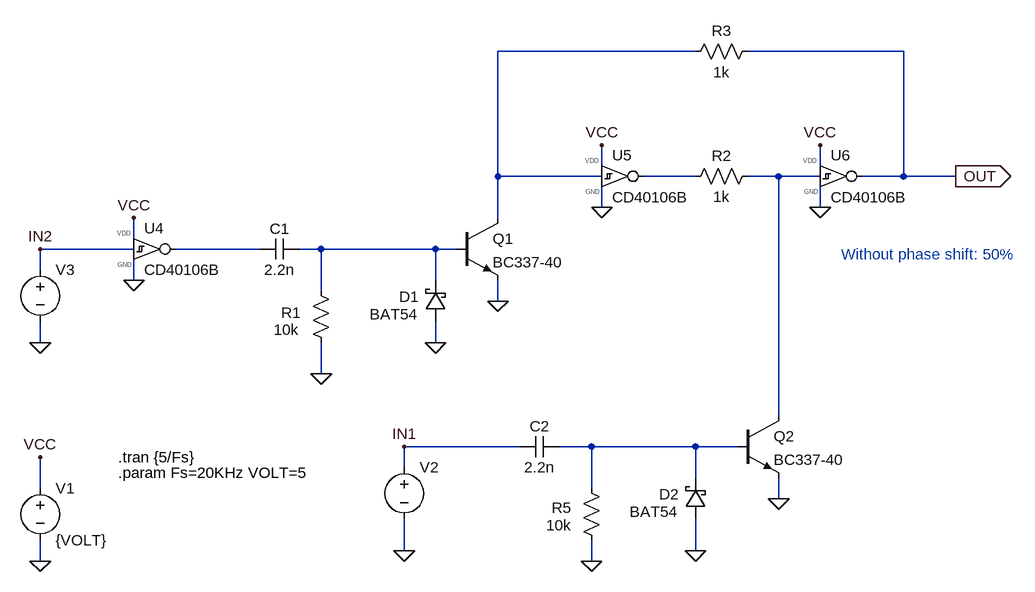
[diagram p0: schematic v1.0.asc]
v1.0.asc, the LTspice schematic file:
Version 4.1
SHEET 1 1776 900
WIRE 1072 48 768 48
WIRE 1392 48 1152 48
WIRE 928 224 928 192
WIRE 1264 224 1264 192
WIRE 768 240 768 48
WIRE 928 240 768 240
WIRE 1072 240 992 240
WIRE 1200 240 1152 240
WIRE 1264 240 1200 240
WIRE 1392 240 1392 48
WIRE 1392 240 1328 240
WIRE 1472 240 1392 240
WIRE 928 288 928 256
WIRE 1264 288 1264 256
WIRE 768 304 768 240
WIRE 208 336 208 304
WIRE 208 352 64 352
WIRE 400 352 272 352
WIRE 496 352 464 352
WIRE 672 352 496 352
WIRE 704 352 672 352
WIRE 64 384 64 352
WIRE 208 400 208 368
WIRE 672 400 672 352
WIRE 496 416 496 352
WIRE 768 432 768 400
WIRE 64 496 64 464
WIRE 672 496 672 464
WIRE 496 544 496 496
WIRE 1200 608 1200 240
WIRE 800 656 624 656
WIRE 912 656 864 656
WIRE 1072 656 912 656
WIRE 1136 656 1072 656
WIRE 624 688 624 656
WIRE 1072 704 1072 656
WIRE 64 720 64 672
WIRE 912 720 912 656
WIRE 1200 736 1200 704
WIRE 624 816 624 768
WIRE 1072 816 1072 768
WIRE 64 832 64 800
WIRE 912 832 912 800
FLAG 64 832 0
FLAG 64 672 VCC
FLAG 208 400 0
FLAG 208 304 VCC
FLAG 64 496 0
FLAG 64 352 IN2
FLAG 1472 240 OUT
IOPIN 1472 240 Out
FLAG 496 544 0
FLAG 768 432 0
FLAG 928 288 0
FLAG 928 192 VCC
FLAG 1264 288 0
FLAG 1264 192 VCC
FLAG 1072 816 0
FLAG 1200 736 0
FLAG 624 816 0
FLAG 624 656 IN1
FLAG 672 496 0
FLAG 912 832 0
SYMBOL voltage 64 704 R0
WINDOW 123 0 0 Left 0
WINDOW 39 0 0 Left 0
SYMATTR InstName V1
SYMATTR Value {VOLT}
SYMBOL voltage 64 368 R0
WINDOW 3 41 64 Invisible 2
WINDOW 123 0 0 Left 0
WINDOW 39 0 0 Left 0
SYMATTR Value PULSE(0 {VOLT} {0.25/Fs} 1n 1n {0.5/Fs} {1/Fs})
SYMATTR InstName V3
SYMBOL cap 400 368 R270
WINDOW 0 32 32 VTop 2
WINDOW 3 0 32 VBottom 2
SYMATTR InstName C1
SYMATTR Value 2.2n
SYMBOL res 480 400 R0
WINDOW 0 -45 50 Left 2
WINDOW 3 -57 76 Left 2
SYMATTR InstName R1
SYMATTR Value 10k
SYMBOL npn 704 304 R0
SYMATTR InstName Q1
SYMATTR Value BC337-40
SYMBOL res 1056 256 R270
WINDOW 0 32 56 VTop 2
WINDOW 3 0 56 VBottom 2
SYMATTR InstName R2
SYMATTR Value 1k
SYMBOL res 1168 32 R90
WINDOW 0 0 56 VBottom 2
WINDOW 3 32 56 VTop 2
SYMATTR InstName R3
SYMATTR Value 1k
SYMBOL cap 800 672 R270
WINDOW 0 32 32 VTop 2
WINDOW 3 0 32 VBottom 2
SYMATTR InstName C2
SYMATTR Value 2.2n
SYMBOL res 896 704 R0
WINDOW 0 -45 46 Left 2
WINDOW 3 -54 73 Left 2
SYMATTR InstName R5
SYMATTR Value 10k
SYMBOL npn 1136 608 R0
SYMATTR InstName Q2
SYMATTR Value BC337-40
SYMBOL voltage 624 672 R0
WINDOW 3 41 64 Invisible 2
WINDOW 123 0 0 Left 0
WINDOW 39 0 0 Left 0
SYMATTR Value PULSE(0 {VOLT} 0 1n 1n {0.5/Fs} {1/Fs})
SYMATTR InstName V2
SYMBOL MyLib\\Digital\\CD40106B 208 320 R0
SYMATTR InstName U4
SYMBOL MyLib\\Digital\\CD40106B 928 208 R0
SYMATTR InstName U5
SYMBOL MyLib\\Digital\\CD40106B 1264 208 R0
SYMATTR InstName U6
SYMBOL schottky 688 464 R180
WINDOW 0 41 39 Left 2
WINDOW 3 44 12 Left 2
SYMATTR InstName D1
SYMATTR Value BAT54
SYMBOL schottky 1088 768 R180
WINDOW 0 41 39 Left 2
WINDOW 3 44 12 Left 2
SYMATTR InstName D2
SYMATTR Value BAT54
TEXT 184 696 Left 2 !.param Fs=20KHz VOLT=5
TEXT 184 672 Left 2 !.tran {5/Fs}
TEXT 1296 360 Left 2 ;Without phase shift: 50%

The netlist it stands for:
* v1.0.asc
V1 VCC 0 {VOLT}
V3 IN2 0 PULSE(0 {VOLT} {0.25/Fs} 1n 1n {0.5/Fs} {1/Fs})
C1 N004 N005 2.2n
R1 N005 0 10k
Q1 N001 N005 0 0 BC337-40
R2 N002 N003 1k
R3 OUT N001 1k
C2 IN1 N006 2.2n
R5 N006 0 10k
Q2 N003 N006 0 0 BC337-40
V2 IN1 0 PULSE(0 {VOLT} 0 1n 1n {0.5/Fs} {1/Fs})
X§U4 IN2 N004 VCC 0 CD40106B vdd=5 speed=2 tripdt=100n  ; pins in out VDD GND
X§U5 N001 N002 VCC 0 CD40106B vdd=5 speed=2 tripdt=100n  ; pins in out VDD GND
X§U6 N003 OUT VCC 0 CD40106B vdd=5 speed=2 tripdt=100n  ; pins in out VDD GND
D1 0 N005 BAT54
D2 0 N006 BAT54
.model D D
.lib standard.dio
.model NPN NPN
.model PNP PNP
.lib standard.bjt
.param Fs=20KHz VOLT=5
.tran {5/Fs}
* Without phase shift: 50%
.lib MyLib/Digital/_CD4xxx.lib
.backanno
.end